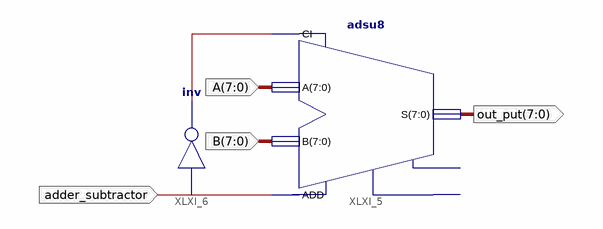
[diagram p0: schematic sheet 1]
// Xilinx ISE schematic avl.sch (spartan6) as structural Verilog: 2 symbols, 4 ports
module avl (
  input  adder_subtractor,
  input  [7:0] B,
  input  [7:0] A,
  output [7:0] out_put
);

  wire XLXN_3;

  adsu8 XLXI_5 (.A(A), .ADD(adder_subtractor), .B(B), .CI(XLXN_3), .S(out_put));  // open: CO, OFL
  not XLXI_6 (XLXN_3, adder_subtractor);
endmodule
